# EAGLE design ROMBO (EAGLE 7.7.0)
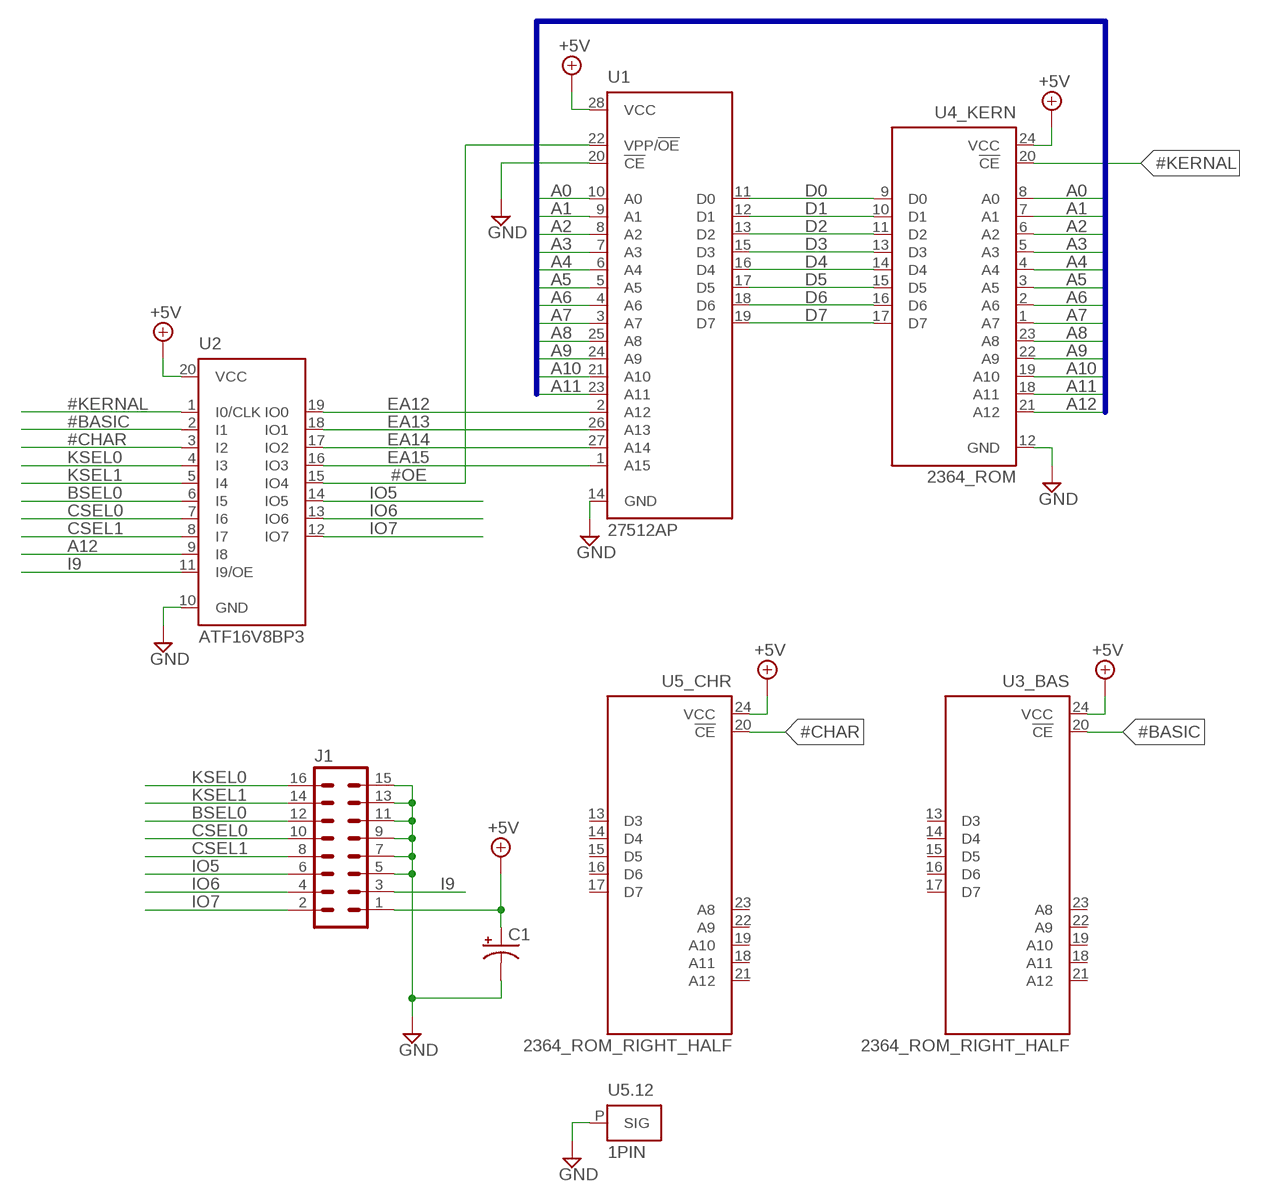
[diagram p0: schematic, sheet 1]

## Parts
C1  CPOL-USE2.5-6  [E2,5-6]
J1  MA08-2  [MA08-2]
U1  27512AP  [DIL28-6]
U2  ATF16V8BP3  [DIL20]
U3_BAS  2364_ROM_RIGHT_HALF  [SIL12]
U4_KERN  2364_ROM  [DIL24-6]
U5.12  1PIN  [1PIN]
U5_CHR  2364_ROM_RIGHT_HALF  [SIL12]

## Nets
#BASIC: U2.2(I1) U3_BAS.20(!CE)
#CHAR: U2.3(I2) U5_CHR.20(!CE)
#KERNAL: U2.1(I0/CLK) U4_KERN.20(!CE)
#OE: U1.22(VPP/!OE) U2.15(IO4)
+5V: C1.+ J1.1 U1.28(VCC) U2.20(VCC) U3_BAS.24(VCC) U4_KERN.24(VCC) U5_CHR.24(VCC)
A0: U1.10(A0) U4_KERN.8(A0)
A1: U1.9(A1) U4_KERN.7(A1)
A2: U1.8(A2) U4_KERN.6(A2)
A3: U1.7(A3) U4_KERN.5(A3)
A4: U1.6(A4) U4_KERN.4(A4)
A5: U1.5(A5) U4_KERN.3(A5)
A6: U1.4(A6) U4_KERN.2(A6)
A7: U1.3(A7) U4_KERN.1(A7)
A8: U1.25(A8) U4_KERN.23(A8)
A9: U1.24(A9) U4_KERN.22(A9)
A10: U1.21(A10) U4_KERN.19(A10)
A11: U1.23(A11) U4_KERN.18(A11)
A12: U2.9(I8) U4_KERN.21(A12)
BSEL0: J1.12 U2.6(I5)
CSEL0: J1.10 U2.7(I6)
CSEL1: J1.8 U2.8(I7)
D0: U1.11(D0) U4_KERN.9(D0)
D1: U1.12(D1) U4_KERN.10(D1)
D2: U1.13(D2) U4_KERN.11(D2)
D3: U1.15(D3) U4_KERN.13(D3)
D4: U1.16(D4) U4_KERN.14(D4)
D5: U1.17(D5) U4_KERN.15(D5)
D6: U1.18(D6) U4_KERN.16(D6)
D7: U1.19(D7) U4_KERN.17(D7)
EA12: U1.2(A12) U2.19(IO0)
EA13: U1.26(A13) U2.18(IO1)
EA14: U1.27(A14) U2.17(IO2)
EA15: U1.1(A15) U2.16(IO3)
GND: C1.- J1.5 J1.7 J1.9 J1.11 J1.13 J1.15 U1.14(GND) U1.20(!CE) U2.10(GND) U4_KERN.12(GND) U5.12.P(SIG)
I9: J1.3 U2.11(I9/OE)
IO5: J1.6 U2.14(IO5)
IO6: J1.4 U2.13(IO6)
IO7: J1.2 U2.12(IO7)
KSEL0: J1.16 U2.4(I3)
KSEL1: J1.14 U2.5(I4)
Unconnected: U3_BAS.13(D3) U3_BAS.14(D4) U3_BAS.15(D5) U3_BAS.16(D6) U3_BAS.17(D7) U3_BAS.18(A11) U3_BAS.19(A10) U3_BAS.21(A12) U3_BAS.22(A9) U3_BAS.23(A8) U5_CHR.13(D3) U5_CHR.14(D4) U5_CHR.15(D5) U5_CHR.16(D6) U5_CHR.17(D7) U5_CHR.18(A11) U5_CHR.19(A10) U5_CHR.21(A12) U5_CHR.22(A9) U5_CHR.23(A8)

## Buses
B$1

## Library data of the parts
C1 = rcl:CPOL-US: POLARIZED CAPACITOR, American symbol
J1 = ROMBO:MA08-2: PIN HEADER; OC_FARNELL: unknown; OC_NEWARK: unknown
U1 = ROMBO:27*512A: CMOS EPROM 512 K (64 K x 8)
U2 = ROMBO:ATF16V8B: High perfomance CMOS (electrically erasable) programmable logic device (PLD) ABLE-Atmel-ABEL - P18V8R, P16V8C, P16V8AS, P17V8 COPL Atmel-WinCUPL - G16V8MS, G16V8MA, G16V8AS, G16V8 LOG/IC - GAL16V8_R, GAL16V8_G7, GAL16V8_C), GAL16V8 Tango-PLD - G16V8R, G16V8C, G16V8AS, G16V8 Source: http://www.atmel.com/dyn/resources/prod_documents/DOC0364.PDF; MPN: ATF16V8CZ-15PU; OC_FARNELL: 1551768; OC_NEWARK: 94M6254
U3_BAS U5_CHR = ROMBO:2364_ROM_RIGHT_HALF
U4_KERN = ROMBO:2364_ROM
U5.12 = ROMBO:1PIN

## Board
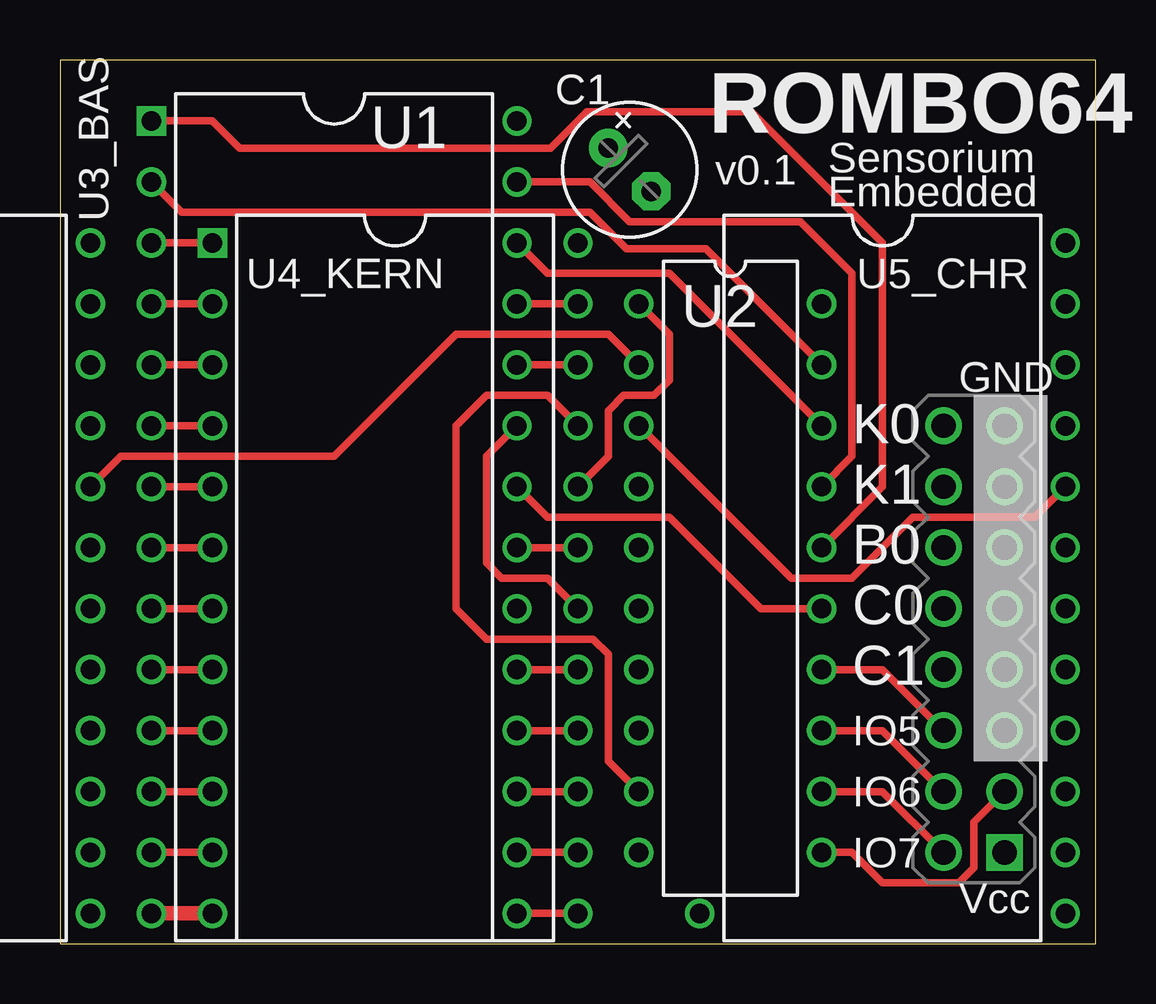
[diagram p1: board, top side]
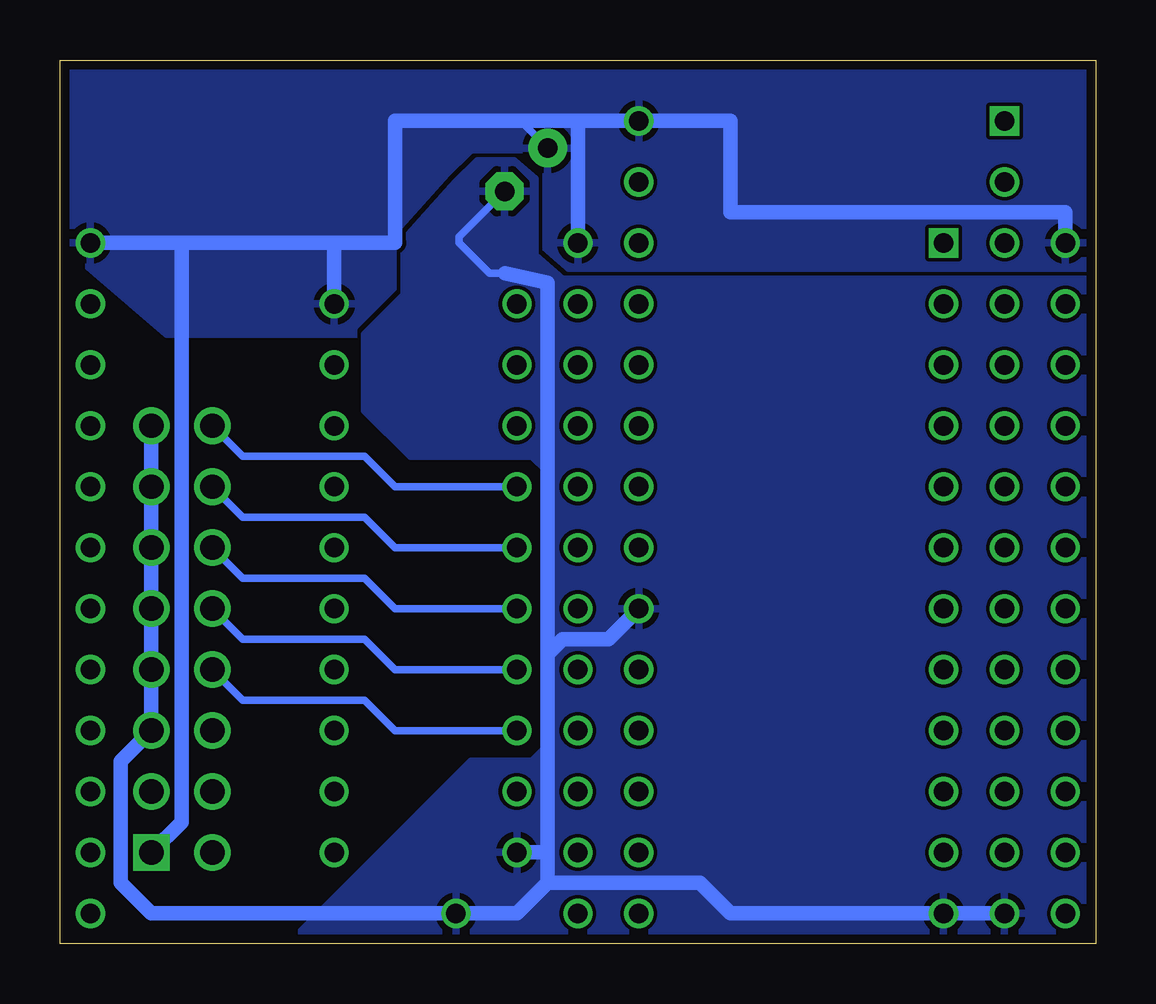
[diagram p2: board, bottom side, seen from below]

Size 43.18 x 36.83 mm. Coordinates in mm from the lower left corner, seen from the top.
Outline: 0,0 43.18,0 43.18,36.83 0,36.83 0,0
Copper layers (1*16): Top 0.0356mm / dielectric 1.5011mm / Bottom 0.0356mm
Design rules "oshpark-2layer": minimum track width 6mil, minimum drill 13mil, track to track 6mil, track to pad 6mil, pad to pad 6mil, via to via 6mil, smd to smd 6mil, copper to edge 15mil, drill to drill 6mil, minimum pad ring 7mil, minimum via ring 7mil, stop-mask expansion 2.5mil, vias tented up to drill 0mil, thermal gap 10mil

### Footprints (pad centres in the part's own frame; a part is rotated, then mirrored left to right if it is on the bottom)
E2,5-6 = drill 0.813 pad 1.6: + -1.27,0 | drill 0.813 pad 1.6 octagon: - 1.27,0
MA08-2 = drill 1.016 square: 1 -8.89,-1.27 | drill 1.016: 2 -8.89,1.27; 3 -6.35,-1.27; 4 -6.35,1.27; 5 -3.81,-1.27; 6 -3.81,1.27; 7 -1.27,-1.27; 8 -1.27,1.27; 9 1.27,-1.27; 10 1.27,1.27; 11 3.81,-1.27; 12 3.81,1.27; 13 6.35,-1.27; 14 6.35,1.27; 15 8.89,-1.27; 16 8.89,1.27
DIL28-6 = drill 0.813 square: 1 -16.51,-7.62 | drill 0.813: 2 -13.97,-7.62; 3 -11.43,-7.62; 4 -8.89,-7.62; 5 -6.35,-7.62; 6 -3.81,-7.62; 7 -1.27,-7.62; 8 1.27,-7.62; 9 3.81,-7.62; 10 6.35,-7.62; 11 8.89,-7.62; 12 11.43,-7.62; 13 13.97,-7.62; 14 16.51,-7.62; 15 16.51,7.62; 16 13.97,7.62; 17 11.43,7.62; 18 8.89,7.62; 19 6.35,7.62; 20 3.81,7.62; 21 1.27,7.62; 22 -1.27,7.62; 23 -3.81,7.62; 24 -6.35,7.62; 25 -8.89,7.62; 26 -11.43,7.62; 27 -13.97,7.62; 28 -16.51,7.62
DIL20 = drill 0.813: 1 -11.43,-3.81; 2 -8.89,-3.81; 3 -6.35,-3.81; 4 -3.81,-3.81; 5 -1.27,-3.81; 6 1.27,-3.81; 7 3.81,-3.81; 8 6.35,-3.81; 9 8.89,-3.81; 10 11.43,-3.81; 11 11.43,3.81; 12 8.89,3.81; 13 6.35,3.81; 14 3.81,3.81; 15 1.27,3.81; 16 -1.27,3.81; 17 -3.81,3.81; 18 -6.35,3.81; 19 -8.89,3.81; 20 -11.43,3.81
SIL12 = drill 0.813: 13 13.97,1.27; 14 11.43,1.27; 15 8.89,1.27; 16 6.35,1.27; 17 3.81,1.27; 18 1.27,1.27; 19 -1.27,1.27; 20 -3.81,1.27; 21 -6.35,1.27; 22 -8.89,1.27; 23 -11.43,1.27; 24 -13.97,1.27
DIL24-6 = drill 0.813 square: 1 -16.51,-7.62 | drill 0.813: 2 -13.97,-7.62; 3 -11.43,-7.62; 4 -8.89,-7.62; 5 -6.35,-7.62; 6 -3.81,-7.62; 7 -1.27,-7.62; 8 1.27,-7.62; 9 3.81,-7.62; 10 6.35,-7.62; 11 8.89,-7.62; 12 11.43,-7.62; 13 11.43,7.62; 14 8.89,7.62; 15 6.35,7.62; 16 3.81,7.62; 17 1.27,7.62; 18 -1.27,7.62; 19 -3.81,7.62; 20 -6.35,7.62; 21 -8.89,7.62; 22 -11.43,7.62; 23 -13.97,7.62; 24 -16.51,7.62
1PIN = drill 0.813: P 0,0

### Placement (x,y rotation side)
C1  23.75,32.26 315 top
J1  38.1,12.7 90 top
U1  11.43,17.78 270 top
U2  27.94,15.24 270 top
U3_BAS  0,15.24 270 top
U4_KERN  13.97,12.7 270 top
U5.12  26.67,1.27 180 top
U5_CHR  40.64,15.24 270 top

### Tracks (layer width: path | path; a pad name or v marks a point on that pad's centre or on a via)
#BASIC
  Top 0.305: U3_BAS.20 2.54,20.32 11.43,20.32 16.51,25.4 22.86,25.4 U2.2
#CHAR
  Top 0.305: U2.3 30.48,15.24 33.02,15.24 35.56,17.78 40.64,17.78 U5_CHR.20
#KERNAL
  Top 0.305: U4_KERN.20 22.86,20.32 22.86,22.23 23.5,22.86 24.77,22.86 25.4,23.5 25.4,25.4 U2.1
#OE
  Top 0.305: U1.22 20.32,17.78 25.4,17.78 29.21,13.97 U2.15
+5V
  Bottom 0.305: C1.+ 23.98,34.29
  Bottom 0.61: U5_CHR.24 38.1,29.21 | 38.1,29.21 31.75,29.21 | 38.1,29.21 38.1,5.08 J1.1 | 21.59,34.29 23.98,34.29 29.21,34.29 29.21,29.21 31.75,29.21 | U3_BAS.24 1.27,30.48 15.24,30.48 15.24,34.29 U1.28 21.59,34.29 | 21.59,34.29 U4_KERN.24 | 31.75,29.21 U2.20
  pour Bottom (rank 2): 0,36.83 43.18,36.83 43.18,29.21 38.73,25.4 0,25.4
A0
  Top 0.305: U1.10 U4_KERN.8
A1
  Top 0.305: U1.9 U4_KERN.7
A2
  Top 0.305: U1.8 U4_KERN.6
A3
  Top 0.305: U1.7 U4_KERN.5
A4
  Top 0.305: U1.6 U4_KERN.4
A5
  Top 0.305: U1.5 U4_KERN.3
A6
  Top 0.305: U1.4 U4_KERN.2
A7
  Top 0.305: U1.3 U4_KERN.1
A8
  Top 0.305: U1.25 U4_KERN.23
A9
  Top 0.305: U1.24 U4_KERN.22
A10
  Top 0.305: U1.21 U4_KERN.19
A11
  Top 0.305: U1.23 17.78,20.32 17.78,15.88 18.41,15.24 20.32,15.24 U4_KERN.18
A12
  Top 0.305: U4_KERN.21 20.32,22.86 17.78,22.86 16.51,21.59 16.51,13.97 17.78,12.7 22.23,12.7 22.86,12.06 22.86,7.62 U2.9
BSEL0
  Bottom 0.305: U2.6 29.21,13.97 30.48,15.24 35.56,15.24 J1.12
CSEL0
  Bottom 0.305: U2.7 29.21,11.43 30.48,12.7 35.56,12.7 J1.10
CSEL1
  Bottom 0.305: U2.8 29.21,8.89 30.48,10.16 35.56,10.16 J1.8
D0
  Top 0.305: U1.11 U4_KERN.9
D1
  Top 0.305: U1.12 U4_KERN.10
D2
  Top 0.305: U1.13 U4_KERN.11
D3
  Top 0.305: U1.15 U4_KERN.13
D4
  Top 0.305: U1.16 U4_KERN.14
D5
  Top 0.305: U1.17 U4_KERN.15
D6
  Top 0.305: U1.18 U4_KERN.16
D7
  Top 0.305: U1.19 U4_KERN.17
EA12
  Top 0.305: U1.2 5.08,30.48 22.1,30.48 23.62,28.96 26.92,28.96 U2.19
EA13
  Top 0.305: U1.26 20.32,27.94 25.4,27.94 U2.18
EA14
  Top 0.305: U2.17 33.02,20.32 33.02,27.94 30.86,30.1 23.75,30.1 22.1,31.75 U1.27
EA15
  Top 0.305: U2.16 34.29,19.05 34.29,29.21 28.83,34.67 21.97,34.67 20.45,33.15 7.49,33.15 6.35,34.29 U1.1
GND
  Top 0.61: U1.14 U4_KERN.12
  Bottom 0.305: C1.- | C1.- 26.54,29.46 26.54,29.21 25.27,27.94 24.64,27.94
  Bottom 0.61: 22.86,2.54 24.13,1.27 U5.12.P 39.37,1.27 40.64,2.54 40.64,7.62 J1.5 J1.7 J1.9 J1.11 J1.13 J1.15 | 22.86,2.54 22.86,3.81 | 22.86,3.81 22.86,12.06 | 22.86,12.06 22.23,12.7 20.32,12.7 U1.20 | U2.10 22.86,3.81 | U1.14 15.24,1.27 16.51,2.54 22.86,2.54 | 24.64,27.94 22.86,27.56 22.86,12.06
  pour Bottom: 0,27.69 22.23,27.69 23.37,28.7 23.37,31.88 24.26,32.64 25.78,32.64 26.67,31.75 28.83,29.34 28.83,27.05 30.48,25.4 30.48,22.23 28.57,20.32 23.5,20.32 22.86,19.68 22.86,8.26 23.5,7.62 26.04,7.62 33.66,0 0,0
I9
  Top 0.305: U2.11 33.02,3.81 34.29,2.54 37.47,2.54 38.1,3.17 38.1,5.08 J1.3
IO5
  Top 0.305: U2.14 34.29,11.43 J1.6
IO6
  Top 0.305: U2.13 34.29,8.89 J1.4
IO7
  Top 0.305: U2.12 34.29,6.35 J1.2
KSEL0
  Bottom 0.305: U2.4 29.21,19.05 30.48,20.32 35.56,20.32 J1.16
KSEL1
  Bottom 0.305: U2.5 29.21,16.51 30.48,17.78 35.56,17.78 J1.14

### Text on the board
tPlace: ROMBO64 | v0.1 | Sensorium / Embedded | GND | K0 / K1 / B0 / C0 / C1 | IO5 / IO6 / IO7 | Vcc